# EAGLE design SK_1.0v (EAGLE 7.5.0)
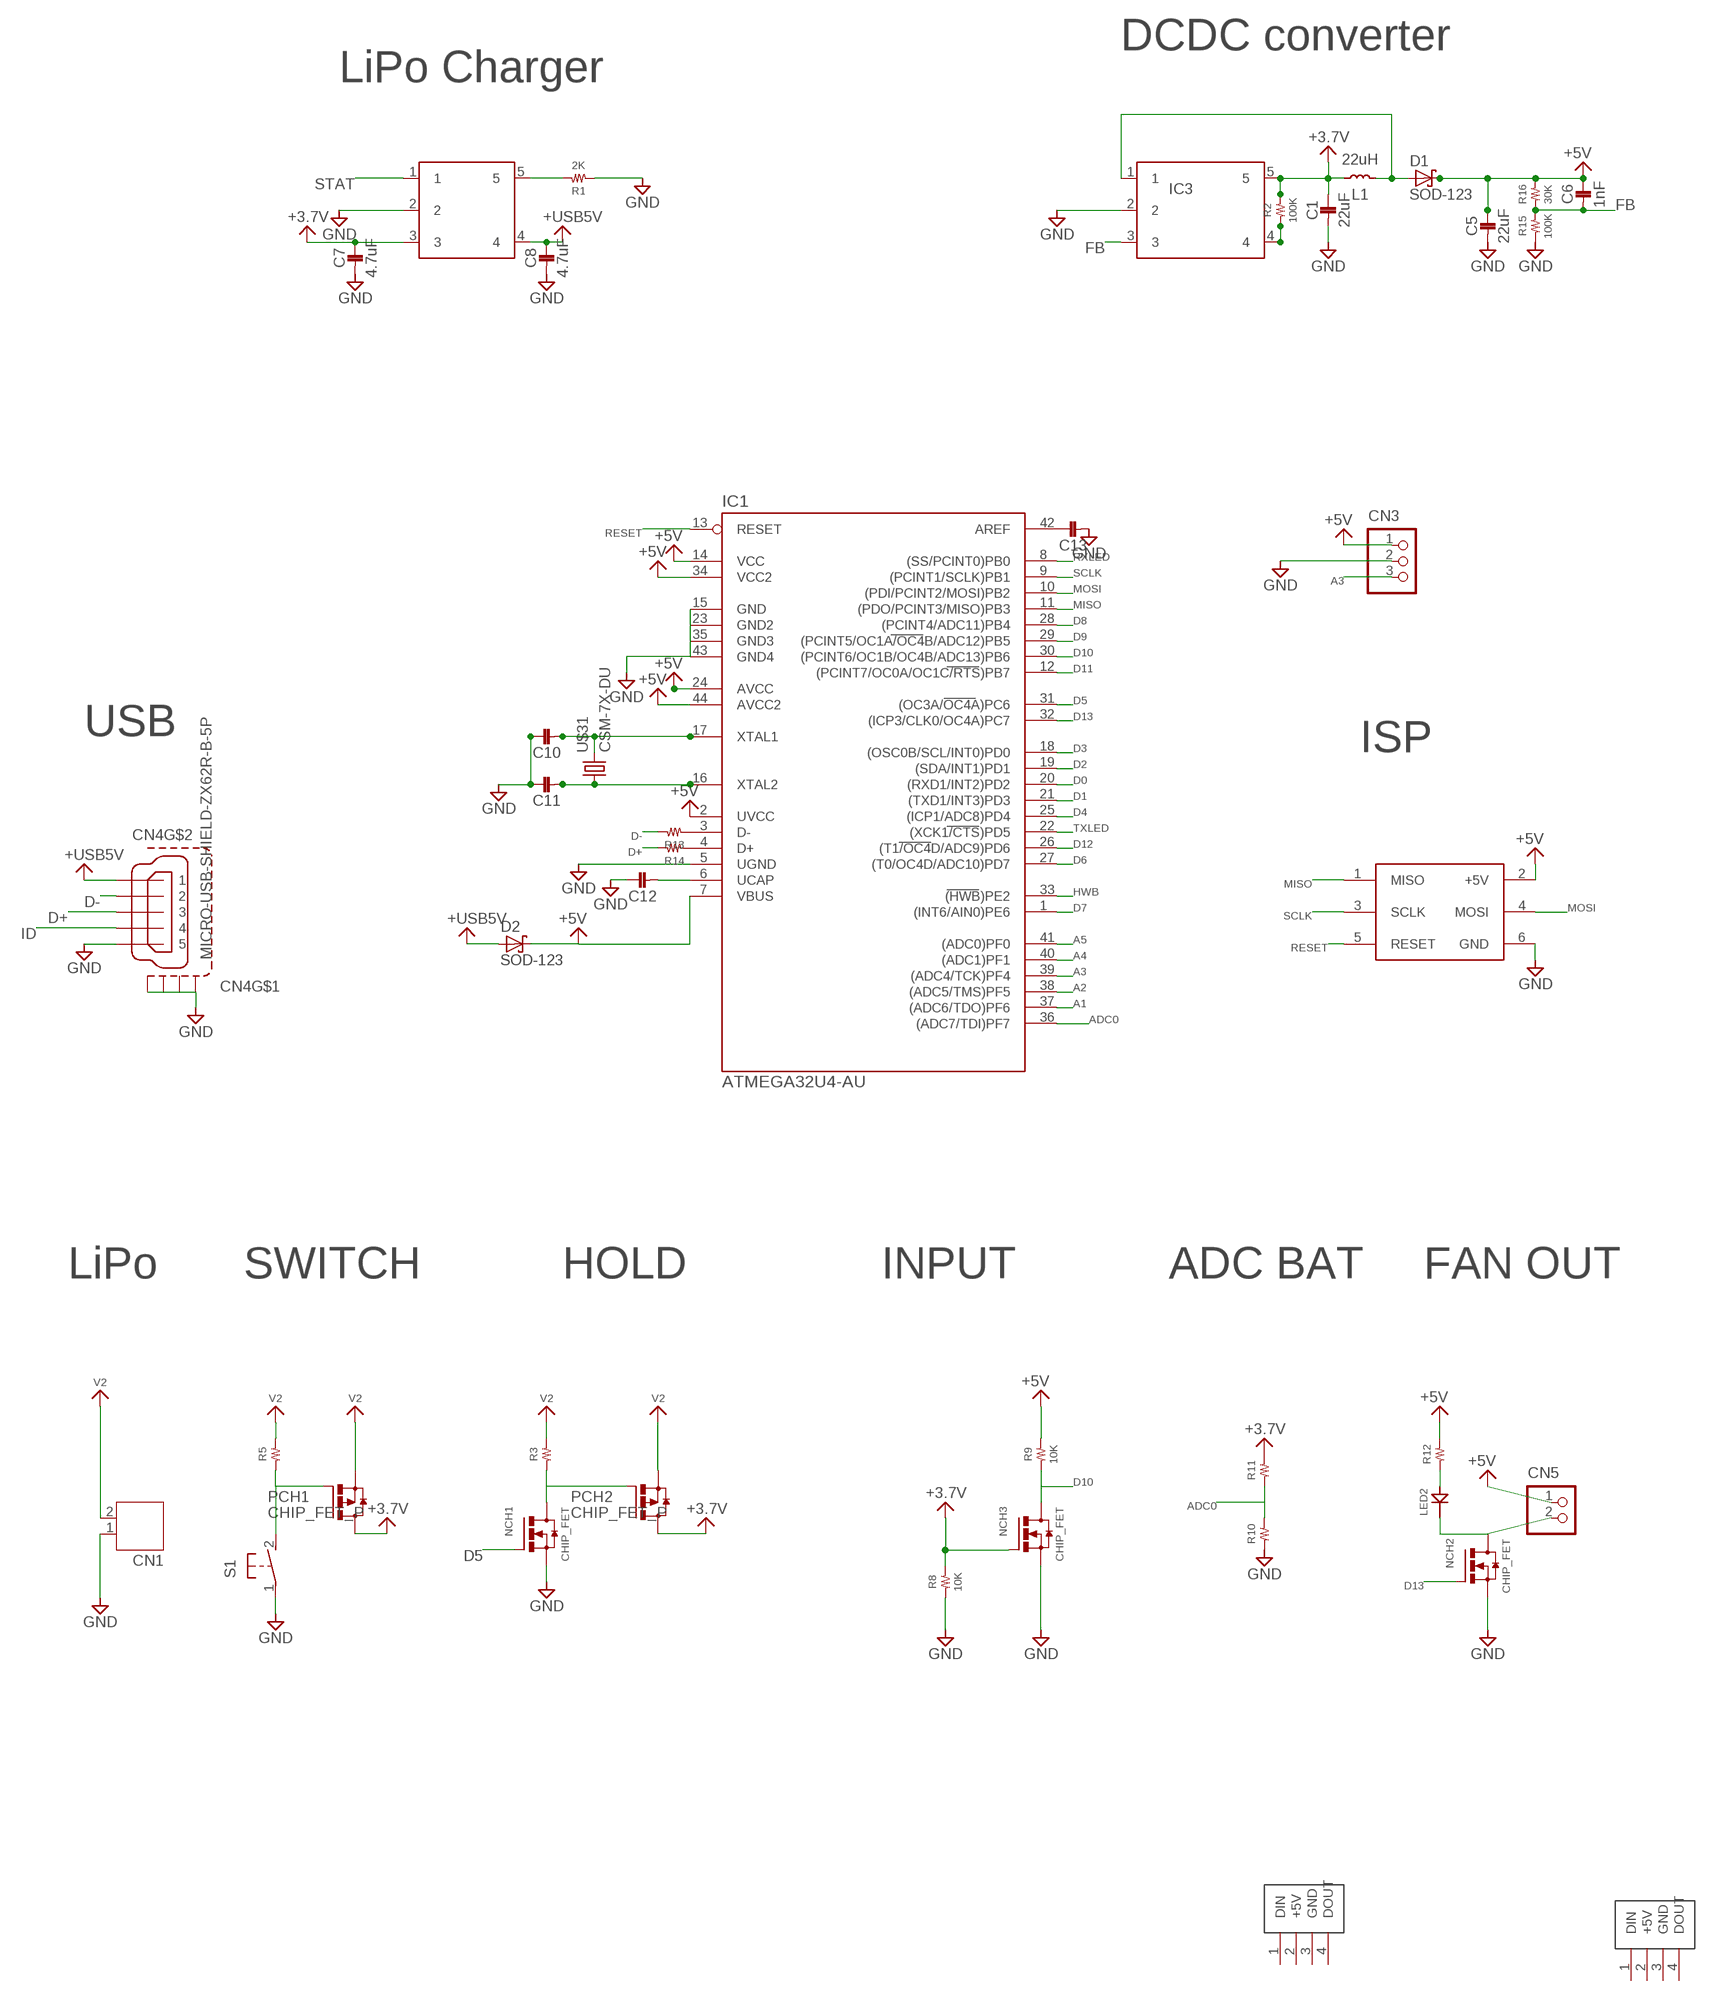
[diagram p0: schematic, sheet 1]

## Parts
C1  22uF  1608  [1608]
C5  22uF  1608  [1608]
C6  1nF  1608  [1608]
C7  4.7uF  1608  [1608]
C8  4.7uF  1608  [1608]
C10  1608  [1608]
C11  1608  [1608]
C12  1608  [1608]
C13  1608  [1608]
CN1  JST-PH2  [JST-PH2]
CN3  B3B-PH-K-S  [B3B-PH-K-S]
CN4  MICRO-USB-SHIELD-ZX62R-B-5P  [ZX62R-B-5P]
CN5  B2B-PH-K-S  [B2B-PH-K-S]
D1  SOD-123  [SOD_123]
D2  SOD-123  [SOD_123]
IC1  ATMEGA32U4-AU  [TQFP44]
IC2  MCP73831  [SOT23-5L]
IC3  LM2735  [SOT23-5L]
L1  22uH  D63  [TOKO]
LED2  5MMLED  [5MM]
NCH1  CHIP_FET  [SOT23]
NCH2  CHIP_FET  [SOT23]
NCH3  CHIP_FET  [SOT23]
PCH1  CHIP_FET_P  [SOT23]
PCH2  CHIP_FET_P  [SOT23]
R1  2K  RESISTOR__SMD  [1608]
R2  100K  RESISTOR__SMD  [1608]
R3  RESISTOR__SMD  [1608]
R5  RESISTOR__SMD  [1608]
R8  10K  RESISTOR__SMD  [1608]
R9  10K  RESISTOR__SMD  [1608]
R10  RESISTOR__SMD  [1608]
R11  RESISTOR__SMD  [1608]
R12  RESISTOR__SMD  [1608]
R13  RESISTOR__SMD  [1608]
R14  RESISTOR__SMD  [1608]
R15  100K  RESISTOR__SMD  [1608]
R16  30K  RESISTOR__SMD  [1608]
S1  31-XX  [B3F-31XX]
U$3  ICSP  [ICSP]
U$31  CSM-7X-DU  [CSM-7X-DU]
U$37  NEO5MM  [NEO5MM]
U$46  NEO5MM  [NEO5MM]

## Nets
+3.7V: C1.P$1 C7.P$1 IC2.3 IC3.5 L1.1 NCH3.1(G) PCH1.3(D) PCH2.3(D) R2.2 R8.2 R11.2
+5V: C5.P$1 C6.P$1 CN3.1 CN5.1 D1.C D2.C IC1.2(UVCC) IC1.7(VBUS) IC1.14(VCC) IC1.24(AVCC) IC1.34(VCC2) IC1.44(AVCC2) R9.2 R12.2 R16.2 U$3.2(+5V)
+USB5V: C8.P$1 CN4.1 D2.A IC2.4
A1: IC1.37((ADC6/TDO)PF6)
A2: IC1.38((ADC5/TMS)PF5)
A3: CN3.3 IC1.39((ADC4/TCK)PF4)
A4: IC1.40((ADC1)PF1)
A5: IC1.41((ADC0)PF0)
ADC0: IC1.36((ADC7/TDI)PF7) R10.2 R11.1
D0: IC1.20((RXD1/INT2)PD2)
D1: IC1.21((TXD1/INT3)PD3)
D2: IC1.19((SDA/INT1)PD1)
D3: IC1.18((OSC0B/SCL/INT0)PD0)
D4: IC1.25((ICP1/ADC8)PD4)
D5: IC1.31((OC3A/OC4A)PC6) NCH1.1(G)
D6: IC1.27((T0/OC4D/ADC10)PD7)
D7: IC1.1((INT6/AIN0)PE6)
D8: IC1.28((PCINT4/ADC11)PB4)
D9: IC1.29((PCINT5/OC1A/OC4B/ADC12)PB5)
D10: IC1.30((PCINT6/OC1B/OC4B/ADC13)PB6) NCH3.3(D) R9.1
D11: IC1.12((PCINT7/OC0A/OC1C/RTS)PB7)
D12: IC1.26((T1/OC4D/ADC9)PD6)
D13: IC1.32((ICP3/CLK0/OC4A)PC7) NCH2.1(G)
D+: CN4.3 R14.2
D-: CN4.2 R13.2
FB: C6.P$2 IC3.3 R15.2 R16.1
GND: C1.P$2 C5.P$2 C7.P$2 C8.P$2 C10.P$1 C11.P$1 C12.P$1 C13.P$2 CN1.1 CN3.2 CN4.5 CN4.M1(S1) CN4.M2(S2) CN4.M3(S3) CN4.M4(S4) IC1.5(UGND) IC1.15(GND) IC1.23(GND2) IC1.35(GND3) IC1.43(GND4) IC2.2 IC3.2 NCH1.2(S) NCH2.2(S) NCH3.2(S) R1.1 R8.1 R10.1 R15.1 S1.1(P) U$3.6(GND)
HWB: IC1.33((HWB)PE2)
ID: CN4.4
MISO: IC1.11((PDO/PCINT3/MISO)PB3) U$3.1(MISO)
MOSI: IC1.10((PDI/PCINT2/MOSI)PB2) U$3.4(MOSI)
N$1: CN5.2 LED2.K NCH2.3(D)
N$2: IC2.5 R1.2
N$3: IC3.4 R2.1
N$4: D1.A IC3.1 L1.2
N$6: NCH1.3(D) PCH2.1(G) R3.1
N$8: IC1.3(D-) R13.1
N$9: C13.P$1 IC1.42(AREF)
N$11: C10.P$2 IC1.17(XTAL1) U$31.2
N$12: LED2.A R12.1
N$13: C11.P$2 IC1.16(XTAL2) U$31.1
N$14: IC1.4(D+) R14.1
N$18: C12.P$2 IC1.6(UCAP)
RESET: IC1.13(RESET) U$3.5(RESET)
RXLED: IC1.8((SS/PCINT0)PB0)
SCLK: IC1.9((PCINT1/SCLK)PB1) U$3.3(SCLK)
STAT: IC2.1
SWSIG: PCH1.1(G) R5.1 S1.2(S)
TXLED: IC1.22((XCK1/CTS)PD5)
V2: CN1.2 PCH1.2(S) PCH2.2(S) R3.2 R5.2
Unconnected: U$37.1(DIN) U$37.2(+5V) U$37.3(GND) U$37.4(DOUT) U$46.1(DIN) U$46.2(+5V) U$46.3(GND) U$46.4(DOUT)

## Notes on the sheet
- DCDC converter
- LiPo Charger
- USB
- ISP
- LiPo | SWITCH | HOLD | INPUT | ADC BAT | FAN OUT

## Library data of the parts
C1 C5-C8 C10-C13 = 02_C:1608
CN1 = jst-ph (1):JST-PH2
CN3 = jst-ph:B3B-PH-*: Wire-to-Board 2.0mm pitch top mount connector Source: http://www.jst-mfg.com/product/pdf/jpn/PH.pdf http://www.jst-mfg.com/product/detail.php?series=199
CN4 = con-hirose1:MICRO-USB-SHIELD-: Hirose Micro USB Connector ZX62R-B-5P: Micro B, reverse (top mount) shell SMT Supplier: DigiKey H11574CT-ND Source: http://www.hirose.co.jp/cataloge_hp/e24200011.pdf
CN5 = jst-ph:B2B-PH-*: Wire-to-Board 2.0mm pitch top mount connector Source: http://www.jst-mfg.com/product/pdf/jpn/PH.pdf http://www.jst-mfg.com/product/detail.php?series=199
D1 D2 = 15_DIODE:SOD-123
IC1 = mega32U4:ATMEGA32U4-AU
IC2 = 04_IC:MCP73831
IC3 = 04_IC:LM2735
L1 = 03_L:D63
LED2 = 10_LED:5MMLED
NCH1-NCH3 = 06_FET:CHIP_FET
PCH1 PCH2 = 06_FET:CHIP_FET_P
R1-R3 R5 R8-R16 = 01_R:RESISTOR__SMD
S1 = switch-omron:31-XX: OMRON SWITCH; MPN: B3F-3100; OC_FARNELL: 959704; OC_NEWARK: 36M3582
U$3 = 08_CONECTOR:ICSP
U$31 = 09_2_CRYSTAL:CSM-7X-DU
U$37 U$46 = 10_LED:NEO5MM

## Board
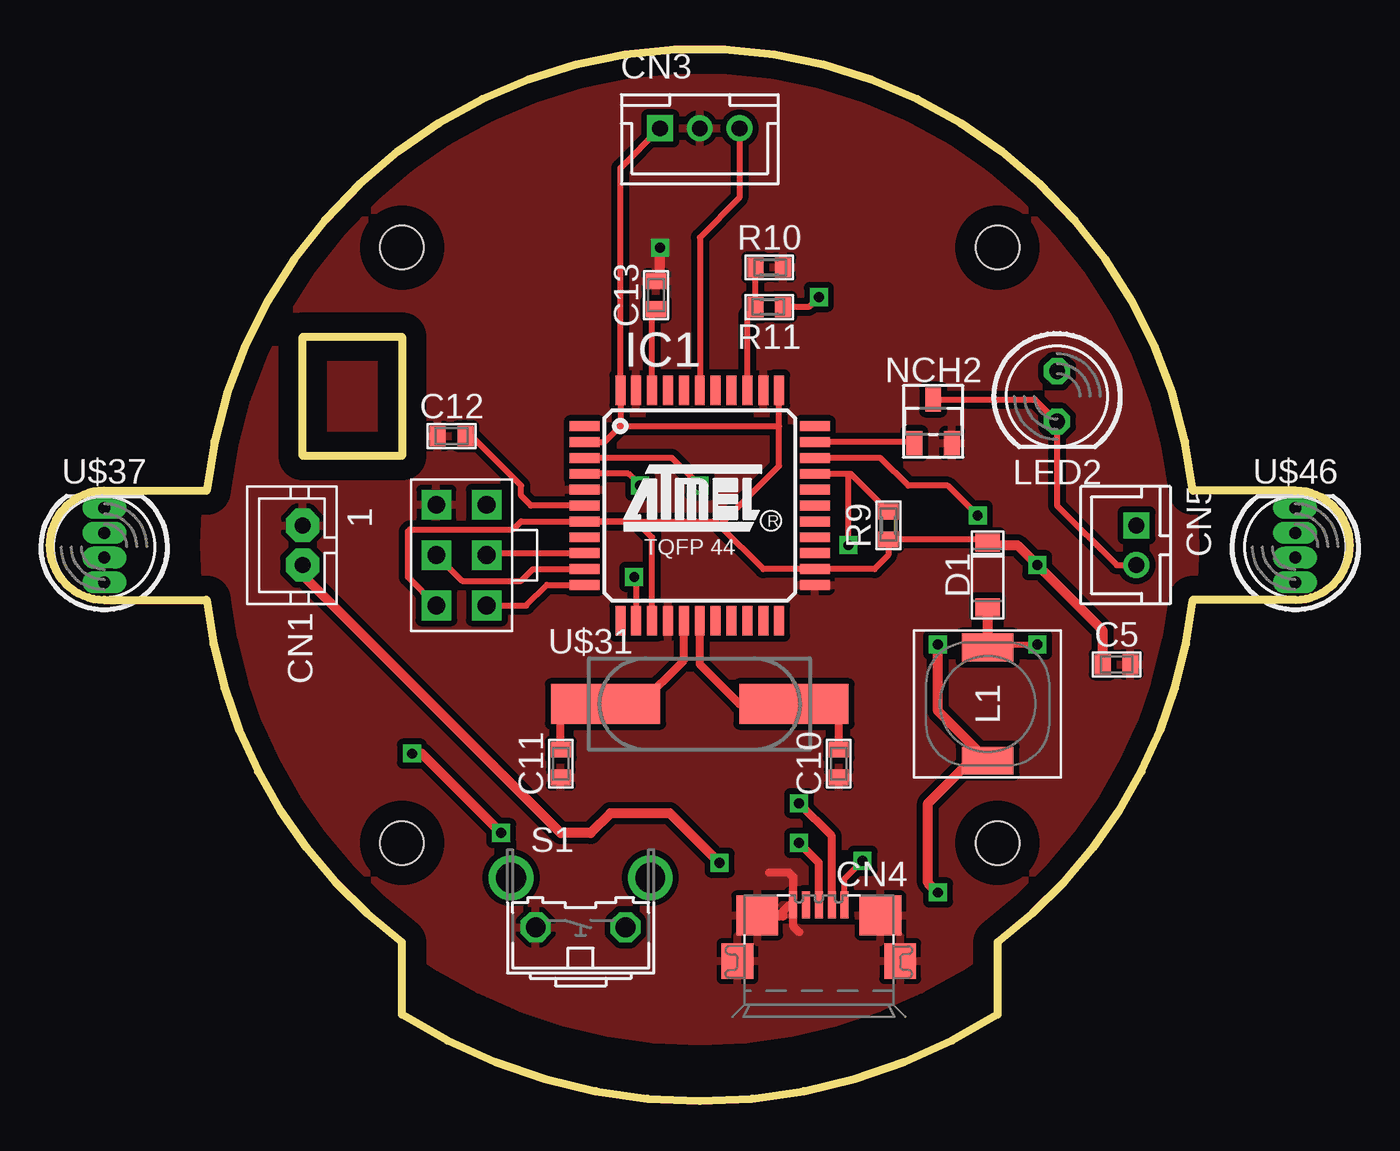
[diagram p1: board, top side]
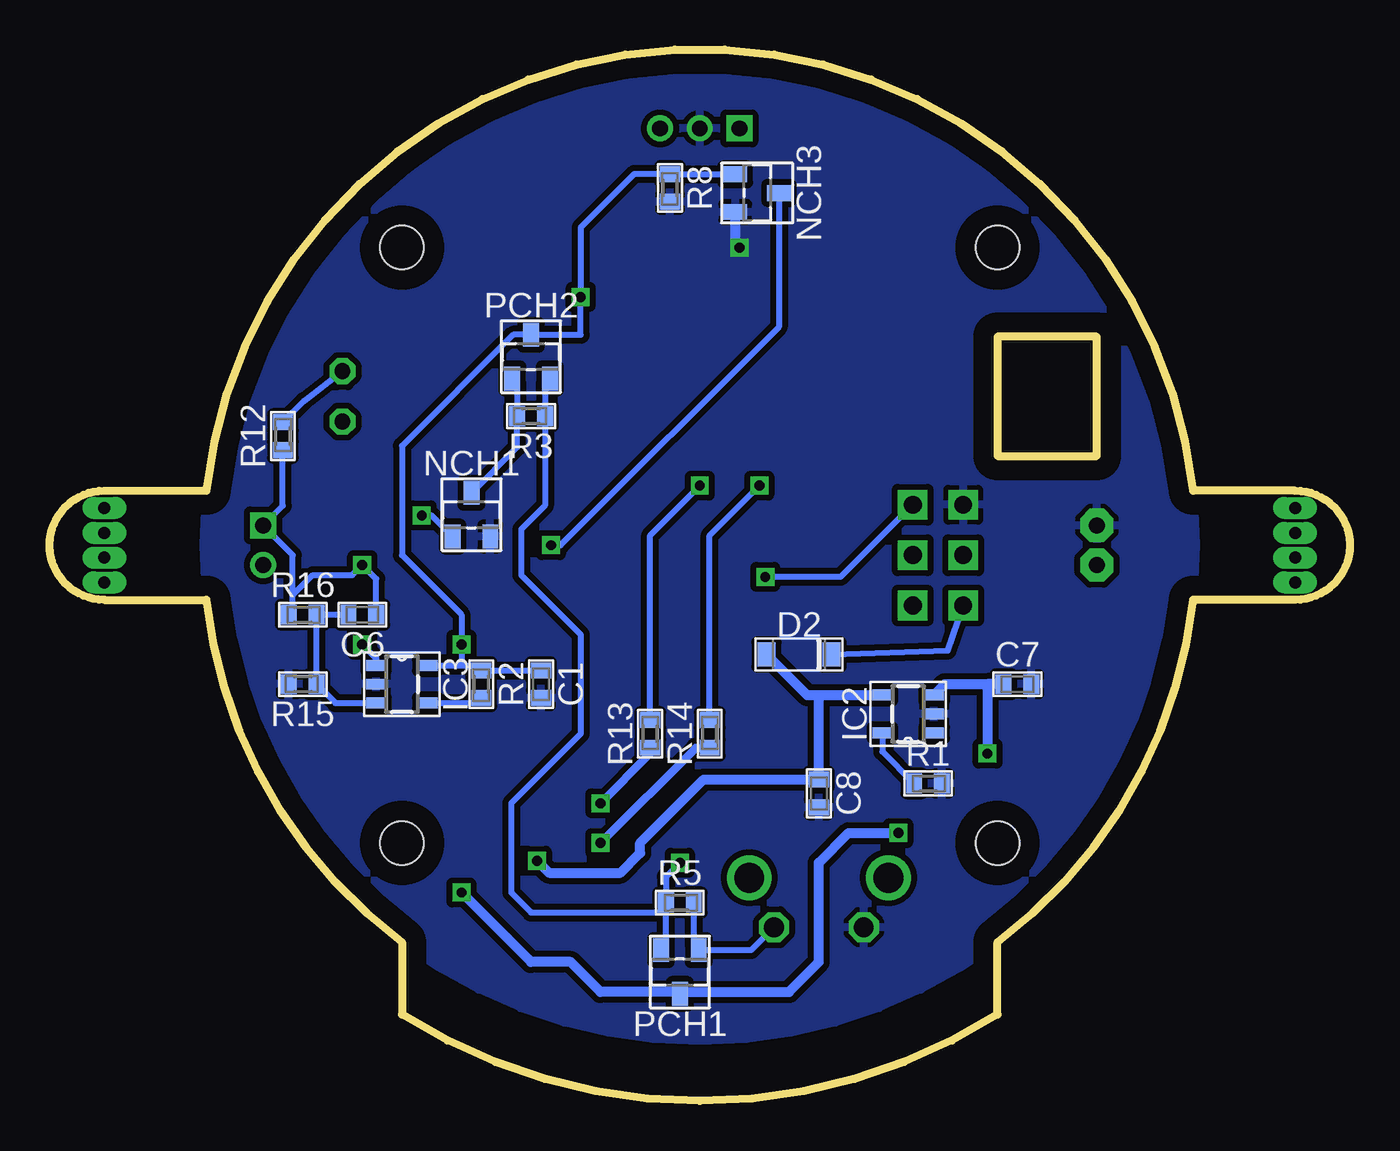
[diagram p2: board, bottom side, seen from below]

Size 65.5 x 52.97 mm. Coordinates in mm from the lower left corner, seen from the top.
Outline: 12.75,38.5 17.75,38.5 17.75,32.5 12.75,32.5 12.75,38.5
Outline: 57.6,30.75 arc167 7.9,30.75 2.75,30.75 arc180 2.75,25.25 7.9,25.25 arc47 17.75,8 17.75,4.36 arc65 47.75,4.36 47.75,8 arc47 57.6,25.25 62.75,25.25 arc180 62.75,30.75 57.6,30.75
Copper layers (1*16): Top 0.035mm / dielectric 1.5mm / Bottom 0.035mm
Design rules "default *": minimum track width 10mil, minimum drill 0.4mm, track to track 8mil, track to pad 8mil, pad to pad 8mil, via to via 8mil, smd to smd 8mil, copper to edge 40mil, drill to drill 8mil, minimum pad ring 10mil, minimum via ring 8mil, stop-mask expansion 4mil, vias tented up to drill 0mil, thermal gap 10mil
Holes 2.2 mm at 17.75,43 17.75,13 47.75,13 47.75,43

### Footprints (pad centres in the part's own frame; a part is rotated, then mirrored left to right if it is on the bottom)
1608 = smd 0.8 x 1: P$1 -0.7,0; P$2 0.7,0
JST-PH2 = drill 0.8 pad 1.676 octagon: 1 1,0; 2 -1,0
B3B-PH-K-S = drill 0.8 square: 1 -2,0 | drill 0.8: 2 0,0; 3 2,0
ZX62R-B-5P = smd 1.35 x 0.4: 1 2.875,-1.3; 2 2.875,-0.65; 3 2.875,0; 4 2.875,0.65; 5 2.875,1.3 | smd 1.8 x 1.6: M1 0.05,-4.1; M2 0.05,4.1 | smd 2 x 2.1: M3 2.35,3.1; M4 2.35,-3.1
B2B-PH-K-S = drill 0.8 square: 1 -1,0 | drill 0.8: 2 1,0
SOD_123 = smd 0.915 x 1.22: A -1.64,0; C 1.64,0
TQFP44 = smd 1.5 x 0.5: 1 -5.8,4; 2 -5.8,3.2; 3 -5.8,2.4; 4 -5.8,1.6; 5 -5.8,0.8; 6 -5.8,0; 7 -5.8,-0.8; 8 -5.8,-1.6; 9 -5.8,-2.4; 10 -5.8,-3.2; 11 -5.8,-4; 23 5.8,-4; 24 5.8,-3.2; 25 5.8,-2.4; 26 5.8,-1.6; 27 5.8,-0.8; 28 5.8,0; 29 5.8,0.8; 30 5.8,1.6; 31 5.8,2.4; 32 5.8,3.2; 33 5.8,4 | smd 0.5 x 1.5: 12 -4,-5.8; 13 -3.2,-5.8; 14 -2.4,-5.8; 15 -1.6,-5.8; 16 -0.8,-5.8; 17 0,-5.8; 18 0.8,-5.8; 19 1.6,-5.8; 20 2.4,-5.8; 21 3.2,-5.8; 22 4,-5.8; 34 4,5.8; 35 3.2,5.8; 36 2.4,5.8; 37 1.6,5.8; 38 0.8,5.8; 39 0,5.8; 40 -0.8,5.8; 41 -1.6,5.8; 42 -2.4,5.8; 43 -3.2,5.8; 44 -4,5.8
SOT23-5L = smd 0.55 x 1: 1 -0.95,-1.3; 2 0,-1.3; 3 0.95,-1.3; 4 0.95,1.3; 5 -0.95,1.3
TOKO = smd 1.4 x 2.6: 1 -2.85,0; 2 2.85,0
5MM = drill 0.8 octagon: A 0,-1.27; K 0,1.27
SOT23 = smd 0.8 x 1.2: 1 -0.95,-1.1; 2 0.95,-1.1; 3 0,1.1
1608' = smd 0.8 x 1: 1 -0.7,0; 2 0.7,0
B3F-31XX = drill 1 octagon: 1 -2.261,-1.245; 2 2.261,-1.245 | drill 1.5 pad 2.159: 3 -3.505,1.245; 4 3.505,1.245
ICSP = drill 0.9 pad 1.5 square: 1 -1.27,2.54; 2 1.27,2.54; 3 -1.27,0; 4 1.27,0; 5 -1.27,-2.54; 6 1.27,-2.54
CSM-7X-DU = smd 5.5 x 2: 1 -4.75,0; 2 4.75,0
NEO5MM = drill 0.6 pad 0.813 long: 1 0,1.875; 2 0,0.625; 3 0,-0.625; 4 0,-1.875

### Placement (x,y rotation side)
C1  40.75,21 270 bottom
C5  53.75,22 0 top
C6  49.75,24.5 180 bottom
C7  16.75,21 0 bottom
C8  26.75,15.5 270 bottom
C10  39.75,17 90 top
C11  25.75,17 90 top
C12  20.25,33.5 0 top
C13  30.55,40.6 90 top
CN1  12.75,28 90 top
CN3  32.75,49 0 top
CN4  38.75,7 90 top
CN5  54.75,28 270 top
D1  47.25,26.5 90 top
D2  27.75,22.5 0 bottom
IC1  32.75,30 0 top
IC2  22.25,19.5 90 bottom
IC3  47.75,21 270 bottom
L1  47.25,20 90 top
LED2  50.75,35.5 180 top
NCH1  44.25,29.54 0 bottom
NCH2  44.51,34.24 0 top
NCH3  29.86,45.74 270 bottom
PCH1  33.75,6.5 180 bottom
PCH2  41.25,37.5 0 bottom
R1  2K  [1608']  21.25,16 180 bottom
R2  100K  [1608']  43.75,21 90 bottom
R3  [1608']  41.25,34.5 0 bottom
R5  [1608']  33.75,10 180 bottom
R8  10K  [1608']  34.25,46 90 bottom
R9  10K  [1608']  42.25,29 270 top
R10  [1608']  36.25,42 180 top
R11  [1608']  36.25,40 0 top
R12  [1608']  53.75,33.5 270 bottom
R13  [1608']  35.25,18.5 270 bottom
R14  [1608']  32.25,18.5 270 bottom
R15  100K  [1608']  52.75,21 0 bottom
R16  30K  [1608']  52.75,24.5 180 bottom
S1  26.75,10 0 top
U$3  20.75,27.5 180 top
U$31  32.75,20 0 top
U$37  2.75,28 0 top
U$46  62.75,28 0 top

### Tracks (layer width: path | path; a pad name or v marks a point on that pad's centre or on a via)
+3.7V  (via drill 0.5)
  Top 0.3: 47.4,17 L1.1 | v38.75,40.5 38.25,40 R11.2 | 47.75,16.65 47.4,17 | 47.4,17 46.75,17
  Top 0.5: v44.75,23 44.75,19.65 L1.1 46.4,17.15 44.25,15 44.25,11 v44.75,10.5 | v22.75,13.5 18.75,17.5 v18.25,17.5
  Bottom 0.3: IC3.5 44.75,21.95 | 44.75,21.95 44,21.95 R2.2 C1.P$1 | 44.75,21.95 v44.75,23 44.75,24.5 47.75,27.5 47.75,33 42.15,38.6 PCH2.3 38.75,38.6 v38.75,40.5 38.75,44 36.05,46.7 R8.2 NCH3.1 | PCH1.3 33.65,5.5 | v18.25,17.5 18.22,17.53
  Bottom 0.5: 33.65,5.5 28.25,5.5 26.75,7 26.75,12 25.25,13.5 v22.75,13.5 | IC2.3 20.4,21 18.25,21 | C7.P$1 18.25,21 | 18.25,21 v18.25,17.5 | PCH1.3 33.85,5.5 37.75,5.5 39.25,7 41.25,7 v44.75,10.5
+5V  (via drill 0.5)
  Top 0.3: U$3.2 18.05,26.39 18.05,28.7 18.15,28.8 23.35,28.8 23.75,29.2 IC1.7 | IC1.14 30.35,28.4 29.55,29.2 IC1.7 | IC1.7 33.55,29.2 33.75,29 | 33.75,29 35.95,26.8 IC1.24 41.55,26.8 42.25,27.5 R9.2 46.95,28.3 47.25,28 D1.C | 33.75,29 36.75,32 36.75,34 | 36.75,34 IC1.34 | 28.75,34 IC1.44 28.75,47 CN3.1 | 28.75,34 36.75,34 | IC1.2 27.95,33.2 28.75,34
  Top 0.5: C5.P$1 53.05,23.7 v49.75,27 48.75,28 47.25,28
  Bottom 0.3: D2.C 20.25,22.69 U$3.2 | R12.2 53.75,30 CN5.1 53.25,27.5 53.25,25.5 | R16.2 53.25,24.7 53.25,25.5 | 53.25,25.5 52.25,26.5 50.25,26.5 v49.75,27 49.05,26.3 C6.P$1
+USB5V  (via drill 0.5)
  Top 0.3: CN4.1 40.05,11.2 v40.95,12.1
  Bottom 0.3: 26.95,16 C8.P$1
  Bottom 0.5: v40.95,12.1 40.35,11.5 36.75,11.5 35.75,12.5 35.75,13 32.55,16.2 C8.P$1 26.75,20.45 | D2.A 27.34,20.45 26.75,20.45 | 26.75,20.45 IC2.4
A3
  Top 0.3: CN3.3 34.75,45.5 32.75,43.5 IC1.39
ADC0
  Top 0.3: IC1.36 35.15,39.6 R11.1 R10.2
D5  (via drill 0.5)
  Top 0.3: v46.75,29.5 45.25,31 43.25,31 41.85,32.4 IC1.31
  Bottom 0.3: NCH1.1 46.26,29.5 v46.75,29.5
D10  (via drill 0.5)
  Top 0.3: v40.25,28 40.25,31.6 | IC1.30 40.25,31.6 | 40.25,31.6 40.35,31.6 R9.1
  Bottom 0.3: NCH3.3 28.76,38.99 39.75,28 v40.25,28
D13
  Top 0.3: 38.61,33.14 IC1.32 43.5,33.2 NCH2.1
D+  (via drill 0.5)
  Top 0.406: CN4.3 38.75,12 v37.75,13
  Bottom 0.406: v37.75,13 32.95,17.8 R14.2
D-  (via drill 0.5)
  Top 0.406: CN4.2 39.4,13.35 v37.75,15
  Bottom 0.406: v37.75,15 35.25,17.5 R13.2
FB
  Bottom 0.3: IC3.3 51.1,20.05 R15.2 R16.1 C6.P$2
GND  (via drill 0.5)
  Top 0.4: 36.25,11.5 37.25,11.5 37.45,11.3 CN4.5 | CN4.5 37.45,8.8 37.75,8.5 | CN4.5 37.27,9.88 36.75,9.35
  Top 0.5: C13.P$2 30.75,41.5 v30.75,43 | 36.92,9.35 36.75,9.35 CN4.M3
  Bottom 0.5: v30.75,43 30.96,43.21 NCH3.2
  pour Bottom (isolate 0.3): 32.75,53 arc90 7.75,28 arc90 32.75,3 arc90 57.75,28 arc90
  pour Top (isolate 0.3): 32.75,53 arc90 7.75,28 arc90 32.75,3 arc90 57.75,28 arc90
MISO
  Top 0.3: U$3.1 24.01,24.96 25.05,26 IC1.11
MOSI
  Top 0.3: U$3.4 20.78,26.2 23.75,26.2 24.35,26.8 IC1.10
N$1
  Top 0.3: NCH2.3 49.64,35.34 LED2.K 50.75,30 53.75,27 CN5.2
N$2
  Bottom 0.3: IC2.5 23.55,17.6 R1.2
N$3
  Bottom 0.3: IC3.4 44,20.05 R2.1
N$4  (via drill 0.5)
  Top 0.3: L1.2 47.4,23 v49.75,23
  Top 0.5: D1.A L1.2
  Bottom 0.3: v49.75,23 49.05,22.3 IC3.1
N$5
  pour Top: 12.75,38.5 17.75,38.5 17.75,32.5 12.75,32.5
N$6
  Bottom 0.3: PCH2.1 41.95,36.15 R3.1 41.95,32.94 NCH1.3
N$8  (via drill 0.5)
  Top 0.3: v32.75,31 31.35,32.4 IC1.3
  Bottom 0.3: R13.1 35.25,28.5 v32.75,31
N$9
  Top 0.3: IC1.42 30.35,39.7 C13.P$1
N$11
  Top 0.406: IC1.17 32.75,22 34.75,20 U$31.2 39.75,20 C10.P$2
N$12
  Bottom 0.3: R12.1 52.68,35.27 LED2.A
N$13
  Top 0.406: IC1.16 31.95,22.2 29.75,20 U$31.1 25.75,20 C11.P$2
N$14  (via drill 0.5)
  Top 0.3: v29.75,31 29.15,31.6 IC1.4
  Bottom 0.3: R14.1 32.25,28.5 v29.75,31
N$18
  Top 0.3: IC1.6 24.25,30 23.75,30.5 23.75,31 21.25,33.5 C12.P$2
RESET  (via drill 0.5)
  Top 0.3: v29.45,26.4 29.55,26.3 IC1.13
  Bottom 0.3: U$3.5 25.66,26.4 v29.45,26.4
SCLK
  Top 0.3: U$3.3 22.12,27.6 IC1.9
SWSIG
  Bottom 0.3: S1.2 30.17,7.6 PCH1.1 33.05,7.85 R5.1
V2  (via drill 0.5)
  Top 0.5: v33.75,12 31.25,14.5 28.25,14.5 27.25,13.5 25.75,13.5 12.75,26.5 CN1.2
  Bottom 0.3: PCH1.2 34.45,7.85 34.45,9.5 | 34.45,9.5 R5.2 34.45,11.3 v33.75,12 | 34.45,9.5 41.25,9.5 42.25,10.5 42.25,15 38.75,18.5 38.75,23.5 41.75,26.5 41.75,28.8 40.55,30 R3.2 40.55,36.15 PCH2.2